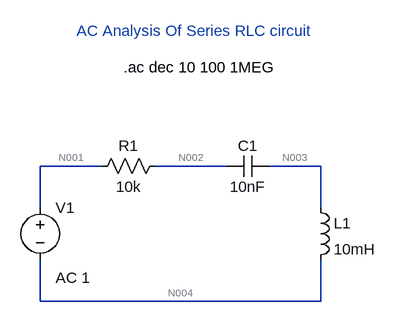
[diagram p0: schematic seriesRLC.asc]
seriesRLC.asc, the LTspice schematic file:
Version 4.1
SHEET 1 880 680
WIRE 96 80 0 80
WIRE 288 80 176 80
WIRE 432 80 352 80
WIRE 0 144 0 80
WIRE 432 144 432 80
WIRE 0 288 0 224
WIRE 432 288 432 224
WIRE 432 288 0 288
SYMBOL voltage 0 128 R0
WINDOW 123 24 124 Left 2
WINDOW 39 0 0 Left 0
SYMATTR Value2 AC 1
SYMATTR InstName V1
SYMATTR Value ""
SYMBOL res 192 64 R90
WINDOW 0 0 56 VBottom 2
WINDOW 3 32 56 VTop 2
SYMATTR InstName R1
SYMATTR Value 10k
SYMBOL cap 352 64 R90
WINDOW 0 0 32 VBottom 2
WINDOW 3 32 32 VTop 2
SYMATTR InstName C1
SYMATTR Value 10nF
SYMBOL ind 416 128 R0
SYMATTR InstName L1
SYMATTR Value 10mH
TEXT 56 -128 Left 2 ;AC Analysis Of Series RLC circuit
TEXT 128 -72 Left 2 !.ac dec 10 100 1MEG

The netlist it stands for:
* seriesRLC.asc
V1 N001 N004 AC 1
R1 N002 N001 10k
C1 N003 N002 10nF
L1 N003 N004 10mH
* AC Analysis Of Series RLC circuit
.ac dec 10 100 1MEG
.backanno
.end

* Results of the author's LTspice run, read from the files saved beside the schematic
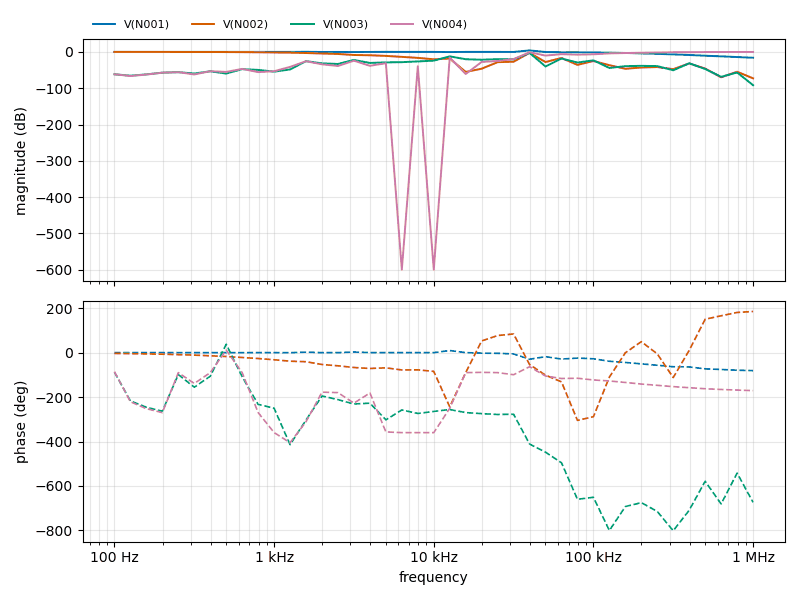
[diagram p1: AC Analysis of seriesRLC.asc, plotted from the saved traces]
* AC Analysis, 1 run:
*   V(N001): 0.00 dB at 100 Hz, -16.07 dB at 1 MHz, peak 4.15 dB at 39.81 kHz, 3 dB below the peak at 33.82 kHz and 46.52 kHz
*   V(N002): -0.02 dB at 100 Hz, -72.76 dB at 1 MHz, peak -0.02 dB at 100 Hz, 3 dB below the peak at 1.573 kHz
*   V(N003): -61.60 dB at 100 Hz, -91.73 dB at 1 MHz, peak -2.87 dB at 39.81 kHz, 3 dB below the peak at 38.28 kHz and 40.56 kHz
*   V(N004): -61.55 dB at 100 Hz, -0.11 dB at 1 MHz, peak -0.11 dB at 1 MHz, 3 dB below the peak at 158.4 kHz